# EasyEDA Pro project ProPrj_闯红灯监控系统_2025-10-04.epro

# Schematic Schematic1
Board Name: Board1; Create Date: 2025-05-07; Page Name: P1; Project Name: 闯红灯监控系统; Schematic Name: Schematic1; Update Date: 2025-06-06; Company: 嘉立创EDA; Page Size: A4; Version: V1.0
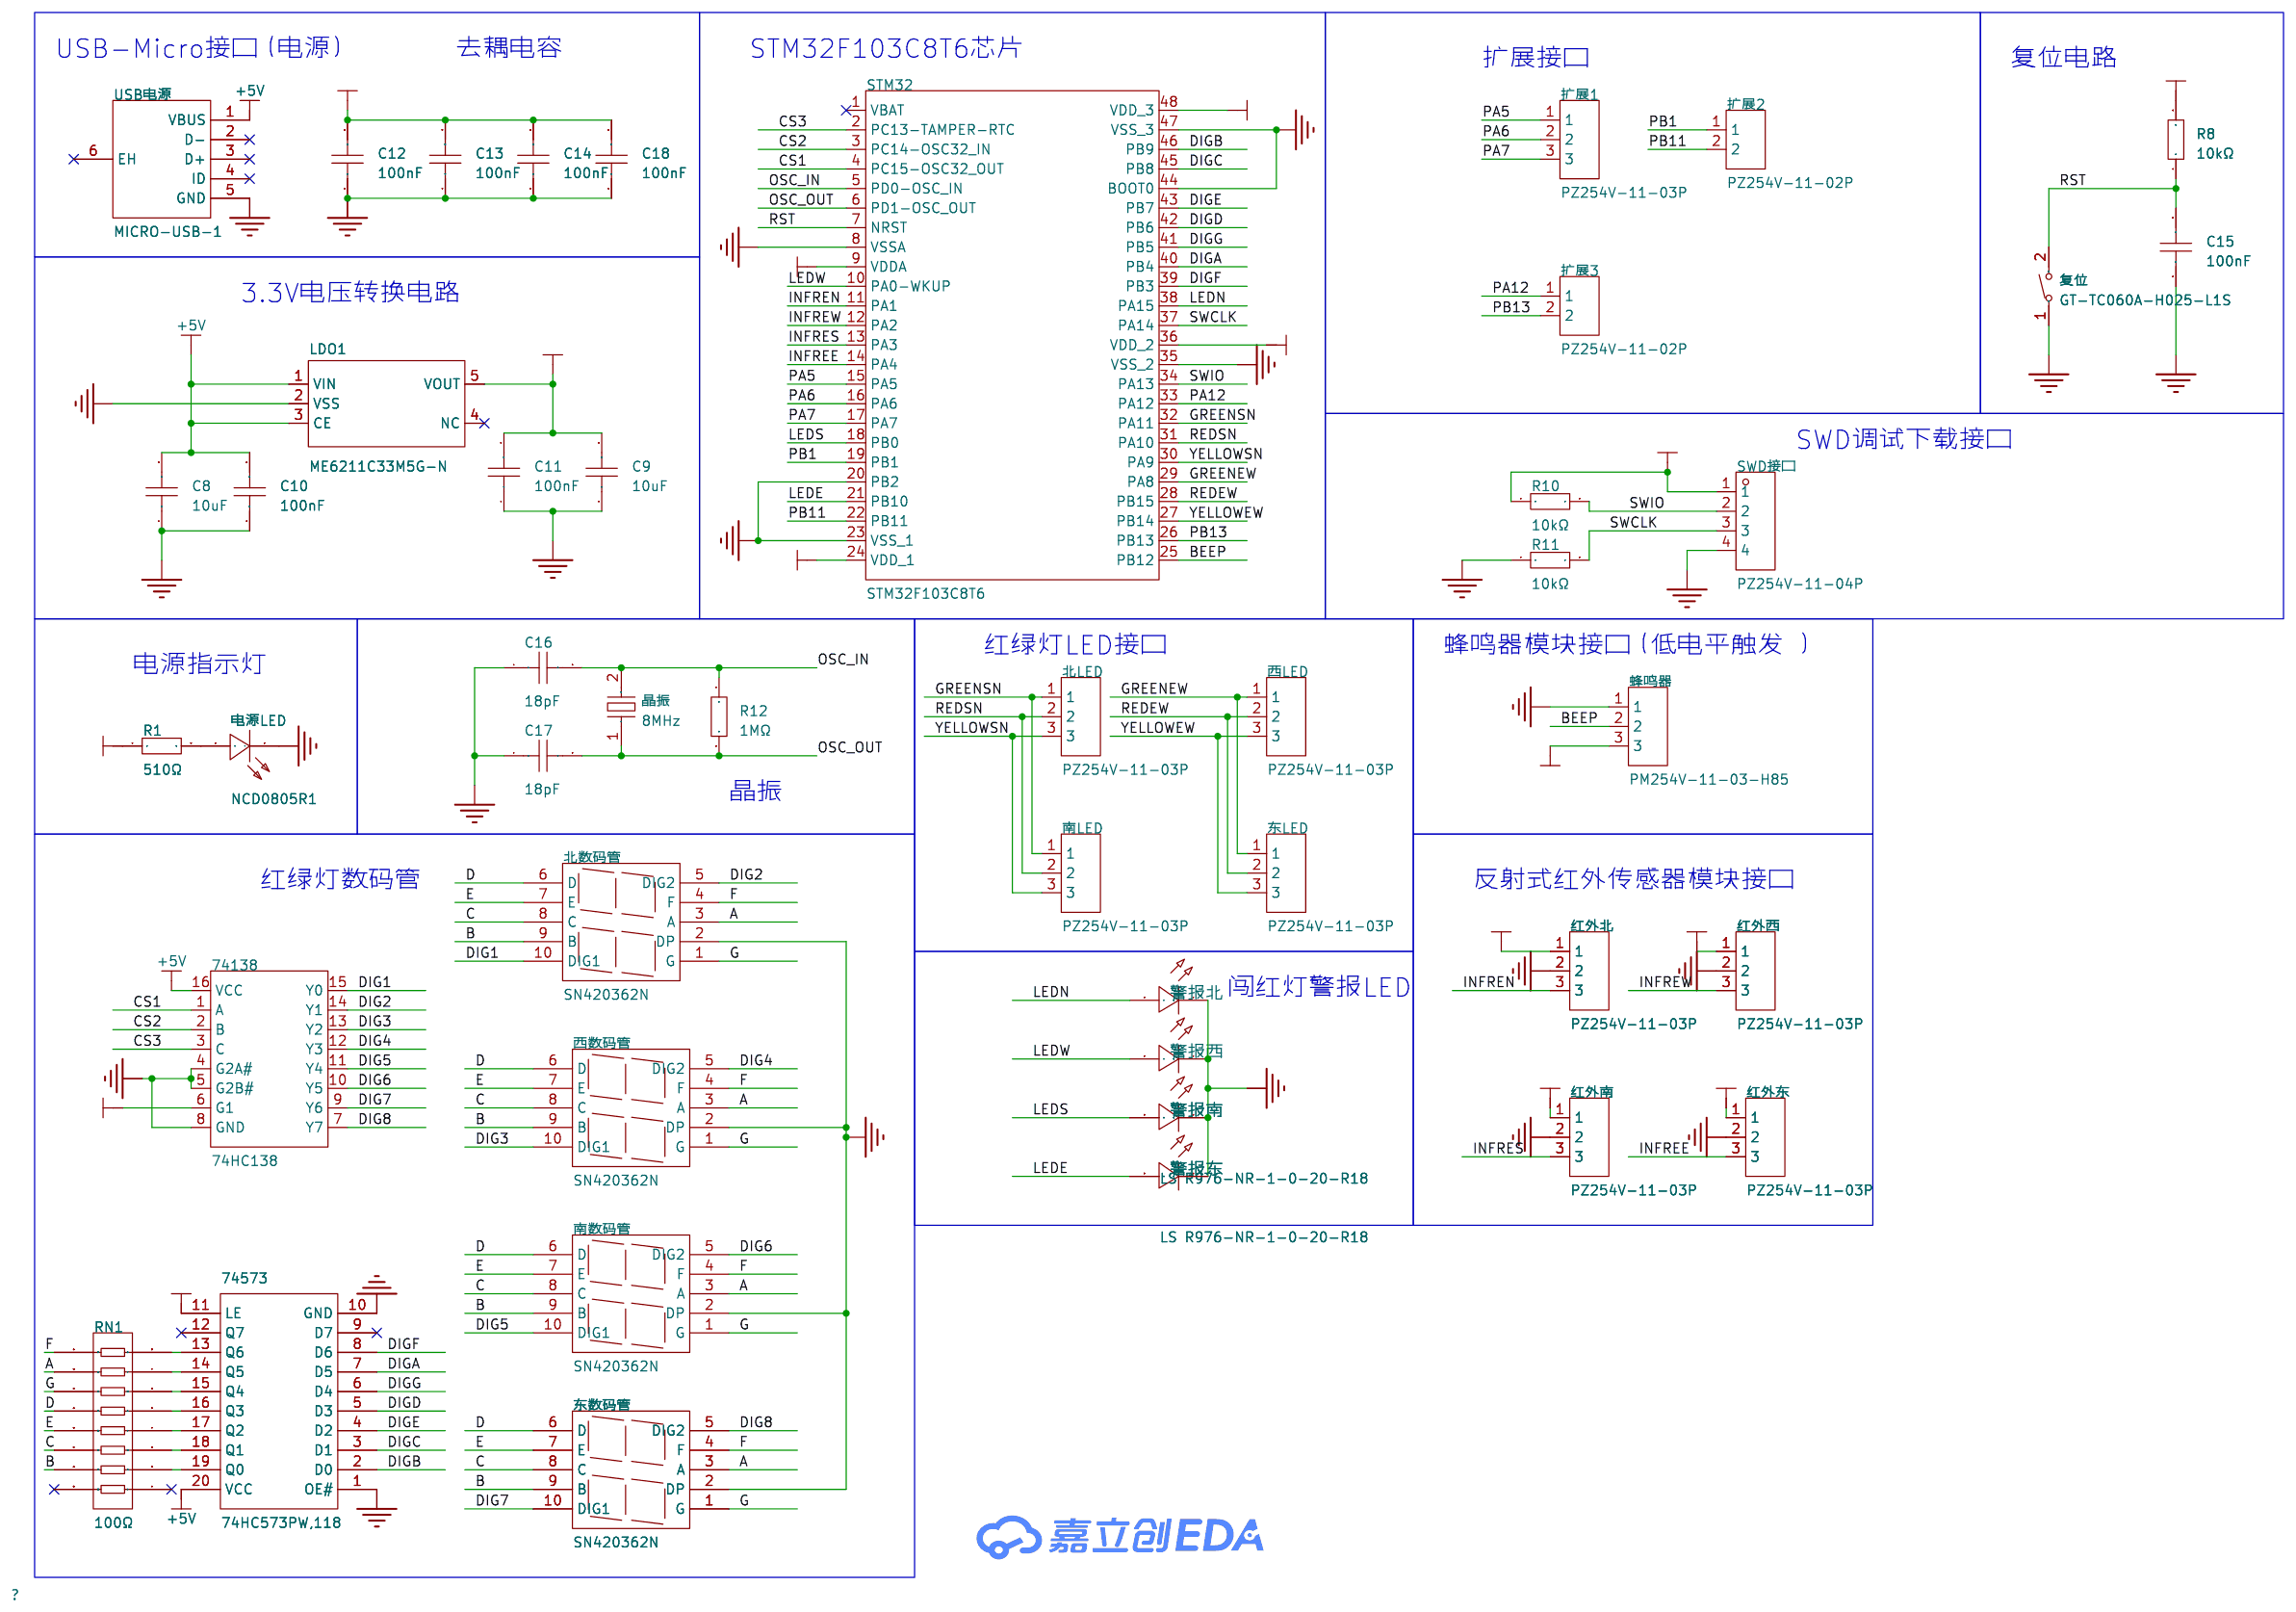
[diagram p0: schematic sheet]

## Parts
74138  74HC138  [SOP-16_L10.0-W3.9-P1.27-LS6.0-BL]
74573  74HC573PW,118  [TSSOP-20_L6.5-W4.4-P0.65-LS6.4-BL]
C8  10uF  [C0805]
C9  10uF  [C0805]
C10  100nF  [C0805]
C11  100nF  [C0805]
C12  100nF  [C0805]
C13  100nF  [C0805]
C14  100nF  [C0805]
C15  100nF  [C0805]
C16  18pF  [C0805]
C17  18pF  [C0805]
C18  100nF  [C0805]
LDO1  ME6211C33M5G-N  [SOT-23-5_L3.0-W1.7-P0.95-LS2.8-BL]
R1  510Ω  [R0805]
R8  10kΩ  [R0805]
R10  10kΩ  [R0805]
R11  10kΩ  [R0805]
R12  1MΩ  [R0805]
RN1  100Ω  [RES-ARRAY-SMD_16P-L3.8-W1.6-P0.50-BL]
STM32  STM32F103C8T6  [LQFP-48_L7.0-W7.0-P0.50-LS9.0-BL]
SWD接口  PZ254V-11-04P  [HDR-TH_4P-P2.54-V-M]
USB电源  MICRO-USB-1  [MICRO-USB-SMD_C9900008946]
东LED  PZ254V-11-03P  [HDR-TH_3P-P2.54-V-M]
东数码管  SN420362N  [LED-SEG-TH_10P-L15.0-W14.0-P2.54-S10.16-BL]
北LED  PZ254V-11-03P  [HDR-TH_3P-P2.54-V-M]
北数码管  SN420362N  [LED-SEG-TH_10P-L15.0-W14.0-P2.54-S10.16-BL]
南LED  PZ254V-11-03P  [HDR-TH_3P-P2.54-V-M]
南数码管  SN420362N  [LED-SEG-TH_10P-L15.0-W14.0-P2.54-S10.16-BL]
复位  GT-TC060A-H025-L1S  [SW-SMD_L6.1-W3.5-LS8.0]
扩展1  PZ254V-11-03P  [HDR-TH_3P-P2.54-V-M]
扩展2  PZ254V-11-02P  [HDR-TH_2P-P2.54-V-M]
扩展3  PZ254V-11-02P  [HDR-TH_2P-P2.54-V-M]
晶振  8MHz  [HC-49US_L11.5-W4.5-P4.88]
电源LED  NCD0805R1  [LED0805-R-RD]
红外东  PZ254V-11-03P  [HDR-TH_3P-P2.54-V-M]
红外北  PZ254V-11-03P  [HDR-TH_3P-P2.54-V-M]
红外南  PZ254V-11-03P  [HDR-TH_3P-P2.54-V-M]
红外西  PZ254V-11-03P  [HDR-TH_3P-P2.54-V-M]
蜂鸣器  PM254V-11-03-H85  [HDR-TH_3P-P2.54-V-F]
西LED  PZ254V-11-03P  [HDR-TH_3P-P2.54-V-M]
西数码管  SN420362N  [LED-SEG-TH_10P-L15.0-W14.0-P2.54-S10.16-BL]
警报东  LS R976-NR-1-0-20-R18  [LED0805-RD_RED]
警报北  北  [LED_0805]
警报南  LS R976-NR-1-0-20-R18  [LED0805-RD_RED]
警报西  西  [LED_0805]

## Library data of the parts
74138 = 74HC138_C18164491: 供电电压:2V~6V;线路数:3~8;灌电流(IOL):5.2mA;拉电流(IOH):5.2mA;; Supplier Part: C18164491; Manufacturer: GR(国睿); Supplier Footprint: SOP-16; JLCPCB Part Class: Extended Part; Datasheet: https://atta.szlcsc.com/upload/public/pdf/source/20230915/1875FD9BBCBC078FA2EE33B300B49074.pdf; Supplier: LCSC; Type: 译码器; Voltage Supply Source: 单电源; Supply Voltage: 2V~6V; Number of lines: 3~8; Sink Current: 5.2mA; Source Current: 5.2mA; Operating temperature: 0℃~+70℃
74573 = 74HC573PW,118: 逻辑类型:D型锁存器;电源电压:2V~6V;通道数:8;传播延迟:14ns;; LCSC Part Name: 三态输出八路D型锁存器; Supplier Part: C5944; Manufacturer: Nexperia(安世); Supplier Footprint: TSSOP-20; JLCPCB Part Class: Extended Part; Datasheet: https://atta.szlcsc.com/upload/public/pdf/source/20240724/96C0CD19AF0910193CE40AAA63B442F9.pdf; Supplier: LCSC; Logic Type: D型锁存器; Output Type: 三态; Supply Voltage: 2V~6V; Number of Channels: 8; Source Current: 7.8mA; Sink Current: 7.8mA; Propagation Delay: 14ns; Series: 74HC; OperatingTemperature: -40℃~+125℃
C8 C9 = CGA0805X5R106K250MT: 容值:10uF;精度:±10%;额定电压:25V;温度系数:X5R;; LCSC Part Name: 10uF ±10% 25V; Supplier Part: C6119887; Manufacturer: HRE(芯声); Supplier Footprint: 0805; JLCPCB Part Class: Extended Part; Supplier: LCSC; Tolerance: ±10%; Voltage Rating: 25V; Temperature Coefficient: X5R
C10-C15 C18 = CC0805KRX7R9BB104: 容值:100nF;精度:±10%;额定电压:50V;材质(温度系数):X7R;; LCSC Part Name: 100nF ±10% 50V; Supplier Part: C49678; Manufacturer: YAGEO(国巨); Supplier Footprint: 0805; JLCPCB Part Class: Basic Part; Datasheet: https://atta.szlcsc.com/upload/public/pdf/source/20180224/C181747_15194369449651363981.pdf; Supplier: LCSC; Tolerance: ±10%; Voltage Rated: 50V; Temperature Coefficient: X7R
C16 C17 = CGA0805C0G180J500HT: 容值:18pF;精度:±5%;额定电压:50V;温度系数:C0G;; LCSC Part Name: 18pF ±5% 50V; Supplier Part: C22399633; Manufacturer: HRE(芯声); Supplier Footprint: 0805; JLCPCB Part Class: Extended Part; Datasheet: https://atta.szlcsc.com/upload/public/pdf/source/20240523/91F7B9E5D9B74CA1D3684C78FC7C8C29.pdf; Supplier: LCSC; Tolerance: ±5%; Voltage Rating: 50V; Temperature Coefficient: C0G
LDO1 = ME6211C33M5G-N: 输出类型:固定;工作电压:6V;输出电压:3.3V;输出电流:500mA;电源纹波抑制比(PSRR):70dB@(1kHz)；62dB@(10kHz);输出极性:正极;; LCSC Part Name: 输入6V 输出3.3V 500mA; Supplier Part: C82942; Manufacturer: MICRONE(南京微盟); Supplier Footprint: SOT-23-5; JLCPCB Part Class: Extended Part; Datasheet: https://atta.szlcsc.com/upload/public/pdf/source/20170918/C82942_1505727073070976520.pdf; Supplier: LCSC; Output Type: 固定; Voltage - Supply: 6V; Output Voltage: 3.3V; Output Current: 500mA; Power Supply Rejection Ratio (PSRR): 70dB@(1kHz)；62dB@(10kHz); Voltage Dropout: 260mV@(200mA); Features: 短路保护(SCP)；低ESR；过流保护(OCP)；带使能; Output Configuration: 正极; Number of Outputs: 1
R1 = 0805W8F5100T5E: 电阻类型:厚膜电阻;阻值:510Ω;精度:±1%;功率:125mW;最大工作电压:150V;温度系数:±100ppm/℃;; LCSC Part Name: 510Ω ±1% 125mW 厚膜电阻; Supplier Part: C17734; Manufacturer: UNI-ROYAL(厚声); Supplier Footprint: 0805; JLCPCB Part Class: Basic Part; Datasheet: https://atta.szlcsc.com/upload/public/pdf/source/20200306/C422600_1E6D84923E4A46A82E41ADD87F860B5C.pdf; Supplier: LCSC; Type: 厚膜电阻; Tolerance: ±1%; Power(Watts): 125mW; Overload Voltage (Max): 150V; Temperature Coefficient: ±100ppm/℃; Operating Temperature Range: -55℃~+155℃
R8 R10 R11 = 0805W8F1002T5E_C17414: 电阻类型:厚膜电阻;阻值:10kΩ;精度:±1%;功率:125mW;最大工作电压:150V;温度系数:±100ppm/℃;; LCSC Part Name: 10kΩ ±1% 125mW 厚膜电阻; Supplier Part: C17414; Manufacturer: UNI-ROYAL(厚声); Manufacturer Part: 0805W8F1002T5E; Supplier Footprint: 0805; JLCPCB Part Class: Basic Part; Datasheet: https://atta.szlcsc.com/upload/public/pdf/source/20200306/C422600_1E6D84923E4A46A82E41ADD87F860B5C.pdf; Supplier: LCSC; Type: 厚膜电阻; Tolerance: ±1%; Power(Watts): 125mW; Overload Voltage (Max): 150V; Temperature Coefficient: ±100ppm/℃; Operating Temperature Range: -55℃~+155℃
R12 = 0805W8F1004T5E: 电阻类型:厚膜电阻;阻值:1MΩ;精度:±1%;功率:125mW;最大工作电压:150V;温度系数:±100ppm/℃;; LCSC Part Name: 1MΩ ±1% 125mW 厚膜电阻; Supplier Part: C17514; Manufacturer: UNI-ROYAL(厚声); Supplier Footprint: 0805; JLCPCB Part Class: Basic Part; Datasheet: https://atta.szlcsc.com/upload/public/pdf/source/20200306/C422600_1E6D84923E4A46A82E41ADD87F860B5C.pdf; Supplier: LCSC; Type: 厚膜电阻; Tolerance: ±1%; Power(Watts): 125mW; Overload Voltage (Max): 150V; Temperature Coefficient: ±100ppm/℃; Operating Temperature Range: -55℃~+155℃
RN1 = EXB2HV101JV: 电阻器数:8;阻值:100Ω;精度:±5%;单个元件功率:63mW;温度系数:±100ppm/℃;; LCSC Part Name: 100Ω ±5%; Supplier Part: C713452; Manufacturer: PANASONIC(松下); Supplier Footprint: SMD-16P,1.6x3.8mm; JLCPCB Part Class: Extended Part; Datasheet: https://atta.szlcsc.com/upload/public/pdf/source/20200731/C713452_CB858C4E526F7E442360E62859A998EA.pdf; Supplier: LCSC; Number of Resistors: 8; Tolerance: ±5%; Power(Watts): 63mW; Temperature Coefficient: ±100ppm/℃; Number of Pins: 16
STM32 = STM32F103C8T6: CPU内核:ARM-M3;CPU最大主频:72MHz;应用领域:-;; LCSC Part Name: 主流增强型ARM Cortex-M3 MCU，具有64 KB Flash、72 MHz CPU、电机控制、USB和CAN; Supplier Part: C8734; Manufacturer: ST(意法半导体); Supplier Footprint: LQFP-48(7x7); JLCPCB Part Class: Extended Part; Datasheet: https://atta.szlcsc.com/upload/public/pdf/source/20220812/8363ACEC51AD55ECEB84799464F7CB85.pdf; Supplier: LCSC; CPU Core: ARM-M3; CPU Maximum Speed: 72MHz; Program Storage Size: 64KB; Program Memory Type: FLASH; Number of I/O: 37; ADC (Bit): 12bit; Low Voltage Detection Threshold: 2V~3.6V
SWD接口 = PZ254V-11-04P: 插针结构:1x4P;间距:2.54mm;行距:-;圆针/方针:方针;安装类型:直插;排数:单排;总PIN位数:4P;额定电流:3A;额定电压:250V;配合针长度:6mm;塑高:2.5mm;端接针长度:3mm;触头材质:-;工作温度范围:-40℃~+105℃;颜色:黑色;; LCSC Part Name: 间距:2.54mm 1x4P 直插 方针; Supplier Part: C2691448; Manufacturer: XFCN(兴飞); Supplier Footprint: 插件,P=2.54mm; JLCPCB Part Class: Extended Part; Datasheet: https://atta.szlcsc.com/upload/public/pdf/source/20200309/C492403_F9F19131791D08044AD4F84F8E751A34.pdf; Supplier: LCSC; Pin Structure: 1x4P; Pitch: 2.54mm; Circluar Pins/Square Pins: 方针; Mounting Type: 直插; Number of Rows: 单排; Number of Pins: 4P; Current Rating (Max): 3A; Voltage Rating (Max): 250V; Length of Mating Pin: 6mm; Insulation Height: 2.5mm; Length of End Connection Pin: 3mm; Operating Temperature Range: -40℃~+105℃; Color: 黑色
USB电源 = MICRO-USB-1: Supplier Part: C9900008946; Supplier Footprint: USB-micro; JLCPCB Part Class: Extended Part; Supplier: LCSC
东LED 北LED 南LED 扩展1 红外东 红外北 红外南 红外西 西LED = PZ254V-11-03P: 插针结构:1x3P;间距:2.54mm;行距:-;圆针/方针:方针;安装方式:直插;排数:单排;总PIN位数:3P;额定电流:3A;额定电压:250V;配合针长度:6mm;塑高:2.5mm;端接针长度:3mm;工作温度:-40℃~+105℃;颜色:黑色;; LCSC Part Name: 1x3P 间距:2.54mm 方针 直插; Supplier Part: C2937625; Manufacturer: XFCN(兴飞); Supplier Footprint: 插件,P=2.54mm; JLCPCB Part Class: Extended Part; Datasheet: https://atta.szlcsc.com/upload/public/pdf/source/20200309/C492402_8335C3D49C4E4C618838D59BB1D024C1.pdf; Supplier: LCSC; Pin Structure: 1x3P; Pitch: 2.54mm; Circluar Pins/Square Pins: 方针; Mounting Type: 直插; Number of Rows: 单排; Number of Pins: 3P; Current Rating: 3A; Voltage Rating (Max): 250V; Length of Mating Pin: 6mm; Insulation Height: 2.5mm; Length of End Connection Pin: 3mm; Operating Temperature: -40℃~+105℃; Color: 黑色
东数码管 北数码管 南数码管 西数码管 = SN420362N: 数码管位数:2位;耗散功率(Pd):50mW;发光颜色:红色;LED极性:共阴极;数字/字母大小(英寸):0.36;; LCSC Part Name: 2位0.36英寸红色数码管 共阴极; Supplier Part: C193138; Manufacturer: ARKLED(方舟); Supplier Footprint: 插件; JLCPCB Part Class: Extended Part; Datasheet: https://atta.szlcsc.com/upload/public/pdf/source/20180614/C193138_5428A70B035656625A7C18FB064A931D.pdf; Supplier: LCSC; Number of Characters: 2位; Display Type: 7段; Size / Dimension: 15mmx14mmx7.2mm; Pd - Power Dissipation: 50mW; Illumination Color: 红色; LED Polarity: 共阴极; Digit/Alpha Size(inch): 0.36
复位 = GT-TC060A-H025-L1S: 电路结构:单刀单掷;作用力:1.6N;安装方式:立贴;带支架:不带;触点电流:50mA;额定电压(AC):12V;额定电压(DC):12V;绝缘电阻:100MΩ;带灯:无;机械寿命:10万次;; LCSC Part Name: 3×6×2.5 立贴 无声轻触开关; Supplier Part: C7450623; Manufacturer: G-Switch(品赞); Supplier Footprint: SMD,3x6mm; JLCPCB Part Class: Extended Part; Datasheet: https://atta.szlcsc.com/upload/public/pdf/source/20230712/3FF422A4BEDB42853830040444FDF292.pdf; Supplier: LCSC; Circuit: 单刀单掷; Operating Force: 1.6N; Mounting Style: 立贴; Strike Gundam: 不带; Contact Current: 50mA; Voltage Rating (AC): 12V; Voltage Rating (DC): 12V; Insulation Resistance: 100MΩ; With Lamp: 无; Mechanical Life: 10万次
扩展2 扩展3 = PZ254V-11-02P: 插针结构:1x2P;间距:2.54mm;行距:-;圆针/方针:方针;安装方式:直插;排数:单排;总PIN位数:2P;额定电流:-;额定电压:-;配合针长度:6mm;塑高:2.5mm;端接针长度:3mm;触头材质:黄铜;触头镀层:-;工作温度:-40℃~+105℃;颜色:黑色;; LCSC Part Name: 1x2P 间距:2.54mm 方针 直插; Supplier Part: C492401; Manufacturer: XFCN(兴飞); Supplier Footprint: 插件,P=2.54mm; JLCPCB Part Class: Extended Part; Datasheet: https://atta.szlcsc.com/upload/public/pdf/source/20200309/C492401_A812433581A9B211A7FFA413ADDFF0E5.pdf; Supplier: LCSC; Pin Structure: 1x2P; Pitch: 2.54mm; Circluar Pins/Square Pins: 方针; Mounting Type: 直插; Number of Rows: 单排; Number of Pins: 2P; Length of Mating Pin: 6mm; Insulation Height: 2.5mm; Length of End Connection Pin: 3mm; Contact Material: 黄铜; Operating Temperature: -40℃~+105℃; Color: 黑色
晶振 = ABL-8.000MHZ-B2-T: 频率:8MHz;常温频差:±20ppm;负载电容:18pF;频率稳定度(全温):±50ppm;; LCSC Part Name: 8MHz ±20ppm 18pF; Supplier Part: C6455706; Manufacturer: ABRACON; Supplier Footprint: HC-49US; JLCPCB Part Class: Extended Part; Datasheet: https://atta.szlcsc.com/upload/public/pdf/source/20231016/AD8D1059740F0944BD2562948A485B35.pdf; Supplier: LCSC; Normal temperature Frequency Tolerance: ±20ppm; Load Capacitor: 18pF; Frequency Stability(Full temperature range): ±50ppm; Equivalent Series Resistance (ESR): 80Ω; Operating Temperature: -20℃~+70℃
电源LED = NCD0805R1: 灯头类型:-;发光颜色:红色;正向电压(VF):1.6V~2.6V;功率:65mW;正向电流:20mA;主波长:615nm~630nm;二极管配置:独立二极管;透镜颜色:无色透明透镜;色温:-;发光强度:67mcd~195mcd;发光角度:130°;载带方式:-;工作温度:-30℃~+85℃;; Supplier Part: C84256; Manufacturer: 国星光电; Supplier Footprint: 0805; JLCPCB Part Class: Basic Part; Datasheet: https://atta.szlcsc.com/upload/public/pdf/source/20200820/C84256_F0A75A43B3EAD75808600A0514C76B99.pdf; Supplier: LCSC; Emitted Color: 红色; Forward Voltage (VF): 1.6V~2.6V; Power Dissipation: 65mW; Forward Current: 20mA; Dominant Wavelength: 615nm~630nm; Diode Configuration: 独立二极管; Lens Color: 无色透明透镜; Luminous Intensity: 67mcd~195mcd; Viewing Angle: 130°; Operating Temperature: -30℃~+85℃
蜂鸣器 = PM254V-11-03-H85: 插孔结构:1x3P;间距:2.54mm;行距:-;安装类型:直插;排数:单排;总孔位数:3P;塑高:-;触头材质:黄铜;触头镀层:-;; LCSC Part Name: 间距:2.54mm 1x3P 直插; Supplier Part: C541850; Manufacturer: XFCN(兴飞); Supplier Footprint: 插件,P=2.54mm; JLCPCB Part Class: Extended Part; Datasheet: https://atta.szlcsc.com/upload/public/pdf/source/20200518/C541849_85853D71FC67C51915A806977A588FDA.pdf; Supplier: LCSC; Holes Structure: 1x3P; Pitch: 2.54mm; Mounting Type: 直插; Number of Rows: 单排; Number of Holes: 3P; Contact Material: 黄铜
警报东 警报南 = LS R976-NR-1-0-20-R18: LCSC Part Name: 0805红(雾状); Supplier Part: C2899997; Manufacturer: OSRAM(欧司朗); Supplier Footprint: 0805; JLCPCB Part Class: Extended Part; Datasheet: https://atta.szlcsc.com/upload/public/pdf/source/20220714/A56A54169E2209C0CCFAD963EE2FAFD1.pdf; Supplier: LCSC
警报北 警报西 = LED_0805-R: Supplier Footprint: 0805

## Nets
+5V: 74138.16(VCC) 74573.20(VCC) C8.2 C10.2 LDO1.1(VIN) LDO1.3(CE) USB电源.1(VBUS)
GND: 74138.4(G2A#) 74138.5(G2B#) 74138.8(GND) 74573.1(OE#) 74573.10(GND) C8.1 C9.1 C10.1 C11.1 C12.1 C13.1 C14.1 C15.1 C16.1 C17.1 C18.1 LDO1.2(VSS) R11.1 STM32.8(VSSA) STM32.20(PB2) STM32.23(VSS_1) STM32.35(VSS_2) STM32.44(BOOT0) STM32.47(VSS_3) SWD接口.4 USB电源.5(GND) 东数码管.2(DP) 北数码管.2(DP) 南数码管.2(DP) 复位.1 电源LED.2(-) 红外东.2 红外北.2 红外南.2 红外西.2 蜂鸣器.1 西数码管.2(DP) 警报东.1(C) 警报北.1(C) 警报南.1(C) 警报西.1(C)
VCC_3V3: 74138.6(G1) 74573.11(LE) C9.2 C11.2 C12.2 C13.2 C14.2 C18.2 LDO1.5(VOUT) R1.1 R8.2 R10.1 STM32.9(VDDA) STM32.24(VDD_1) STM32.36(VDD_2) STM32.48(VDD_3) SWD接口.1 红外东.1 红外北.1 红外南.1 红外西.1 蜂鸣器.3
A: RN1.10 东数码管.3(A) 北数码管.3(A) 南数码管.3(A) 西数码管.3(A)
B: RN1.15 东数码管.9(B) 北数码管.9(B) 南数码管.9(B) 西数码管.9(B)
BEEP: STM32.25(PB12) 蜂鸣器.2
C: RN1.14 东数码管.8(C) 北数码管.8(C) 南数码管.8(C) 西数码管.8(C)
CS1: 74138.1(A) STM32.4(PC15-OSC32_OUT)
CS2: 74138.2(B) STM32.3(PC14-OSC32_IN)
CS3: 74138.3(C) STM32.2(PC13-TAMPER-RTC)
D: RN1.12 东数码管.6(D) 北数码管.6(D) 南数码管.6(D) 西数码管.6(D)
DIG1: 74138.15(Y0) 北数码管.10(DIG1)
DIG2: 74138.14(Y1) 北数码管.5(DIG2)
DIG3: 74138.13(Y2) 西数码管.10(DIG1)
DIG4: 74138.12(Y3) 西数码管.5(DIG2)
DIG5: 74138.11(Y4) 南数码管.10(DIG1)
DIG6: 74138.10(Y5) 南数码管.5(DIG2)
DIG7: 74138.9(Y6) 东数码管.10(DIG1)
DIG8: 74138.7(Y7) 东数码管.5(DIG2)
DIGA: 74573.7(D5) STM32.40(PB4)
DIGB: 74573.2(D0) STM32.46(PB9)
DIGC: 74573.3(D1) STM32.45(PB8)
DIGD: 74573.5(D3) STM32.42(PB6)
DIGE: 74573.4(D2) STM32.43(PB7)
DIGF: 74573.8(D6) STM32.39(PB3)
DIGG: 74573.6(D4) STM32.41(PB5)
E: RN1.13 东数码管.7(E) 北数码管.7(E) 南数码管.7(E) 西数码管.7(E)
F: RN1.9 东数码管.4(F) 北数码管.4(F) 南数码管.4(F) 西数码管.4(F)
G: RN1.11 东数码管.1(G) 北数码管.1(G) 南数码管.1(G) 西数码管.1(G)
GREENEW: STM32.29(PA8) 东LED.1 西LED.1
GREENSN: STM32.32(PA11) 北LED.1 南LED.1
INFREE: STM32.14(PA4) 红外东.3
INFREN: STM32.11(PA1) 红外北.3
INFRES: STM32.13(PA3) 红外南.3
INFREW: STM32.12(PA2) 红外西.3
LEDE: STM32.21(PB10) 警报东.2(A)
LEDN: STM32.38(PA15) 警报北.2(A)
LEDS: STM32.18(PB0) 警报南.2(A)
LEDW: STM32.10(PA0-WKUP) 警报西.2(A)
OSC_IN: C16.2 R12.1 STM32.5(PD0-OSC_IN) 晶振.2
OSC_OUT: C17.2 R12.2 STM32.6(PD1-OSC_OUT) 晶振.1
PA5: STM32.15(PA5) 扩展1.1
PA6: STM32.16(PA6) 扩展1.2
PA7: STM32.17(PA7) 扩展1.3
PA12: STM32.33(PA12) 扩展3.1
PB1: STM32.19(PB1) 扩展2.1
PB11: STM32.22(PB11) 扩展2.2
PB13: STM32.26(PB13) 扩展3.2
REDEW: STM32.28(PB15) 东LED.2 西LED.2
REDSN: STM32.31(PA10) 北LED.2 南LED.2
RST: C15.2 R8.1 STM32.7(NRST) 复位.2
SWCLK: R11.2 STM32.37(PA14) SWD接口.3
SWIO: R10.2 STM32.34(PA13) SWD接口.2
YELLOWEW: STM32.27(PB14) 东LED.3 西LED.3
YELLOWSN: STM32.30(PA9) 北LED.3 南LED.3
$1N2600: R1.2 电源LED.1(+)
$1N11019: 74573.19(Q0) RN1.2
$1N11023: 74573.18(Q1) RN1.3
$1N11028: 74573.17(Q2) RN1.4
$1N11033: 74573.16(Q3) RN1.5
$1N11038: 74573.15(Q4) RN1.6
$1N11043: 74573.14(Q5) RN1.7
$1N11048: 74573.13(Q6) RN1.8

Not connected (* = marked no-connect by the designer): 74573 9(D7)* 12(Q7)*; LDO1 4(NC)*; RN1 1* 16*; STM32 1(VBAT)*; USB电源 2(D-)* 3(D+)* 4(ID)* 6(EH)*

## Notes on the sheet
- USB-Micro接口（电源）
- 去耦电容
- STM32F103C8T6芯片
- 扩展接口
- 复位电路
- 3.3V电压转换电路
- SWD调试下载接口
- 红绿灯LED接口
- 蜂鸣器模块接口（低电平触发 ）
- 电源指示灯
- 晶振
- 红绿灯数码管
- 反射式红外传感器模块接口
- 闯红灯警报LED

# Board PCB1
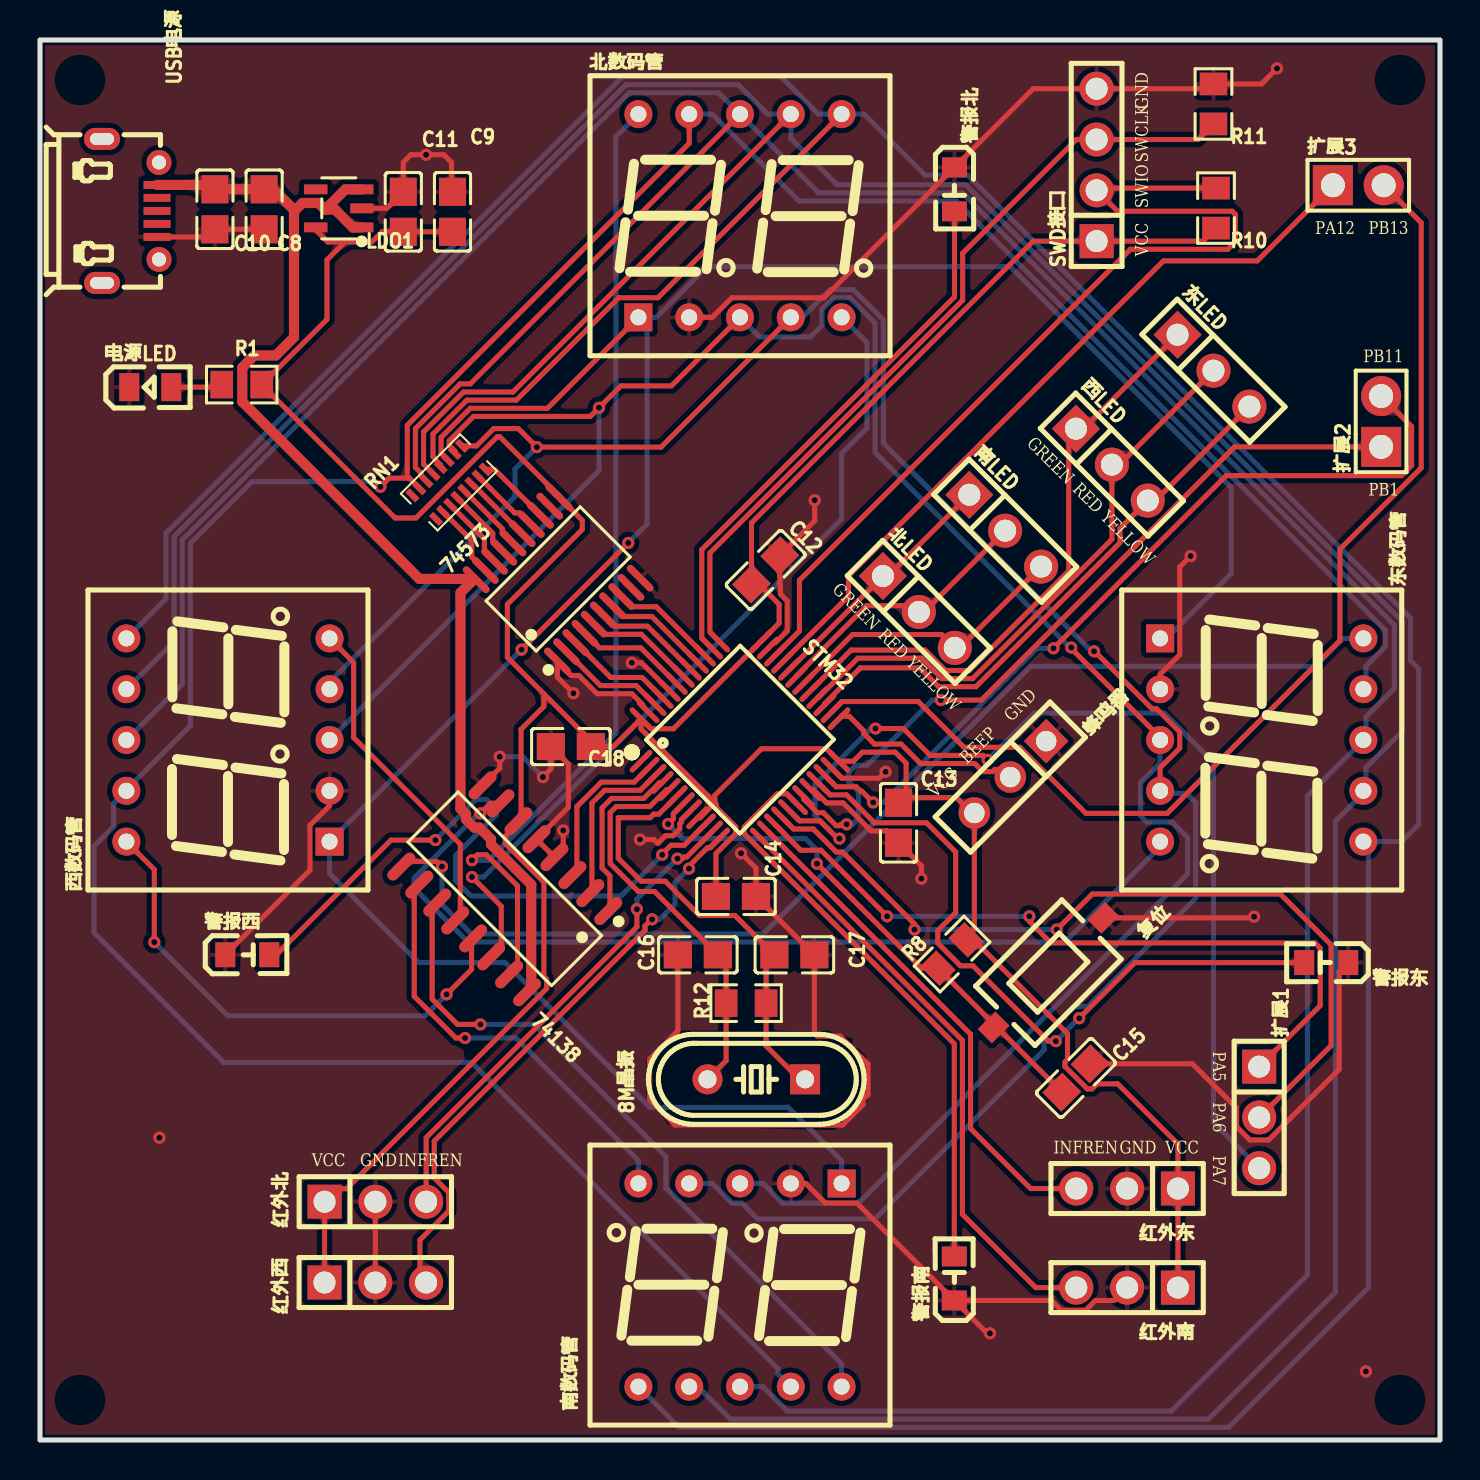
[diagram p1: board, top side]
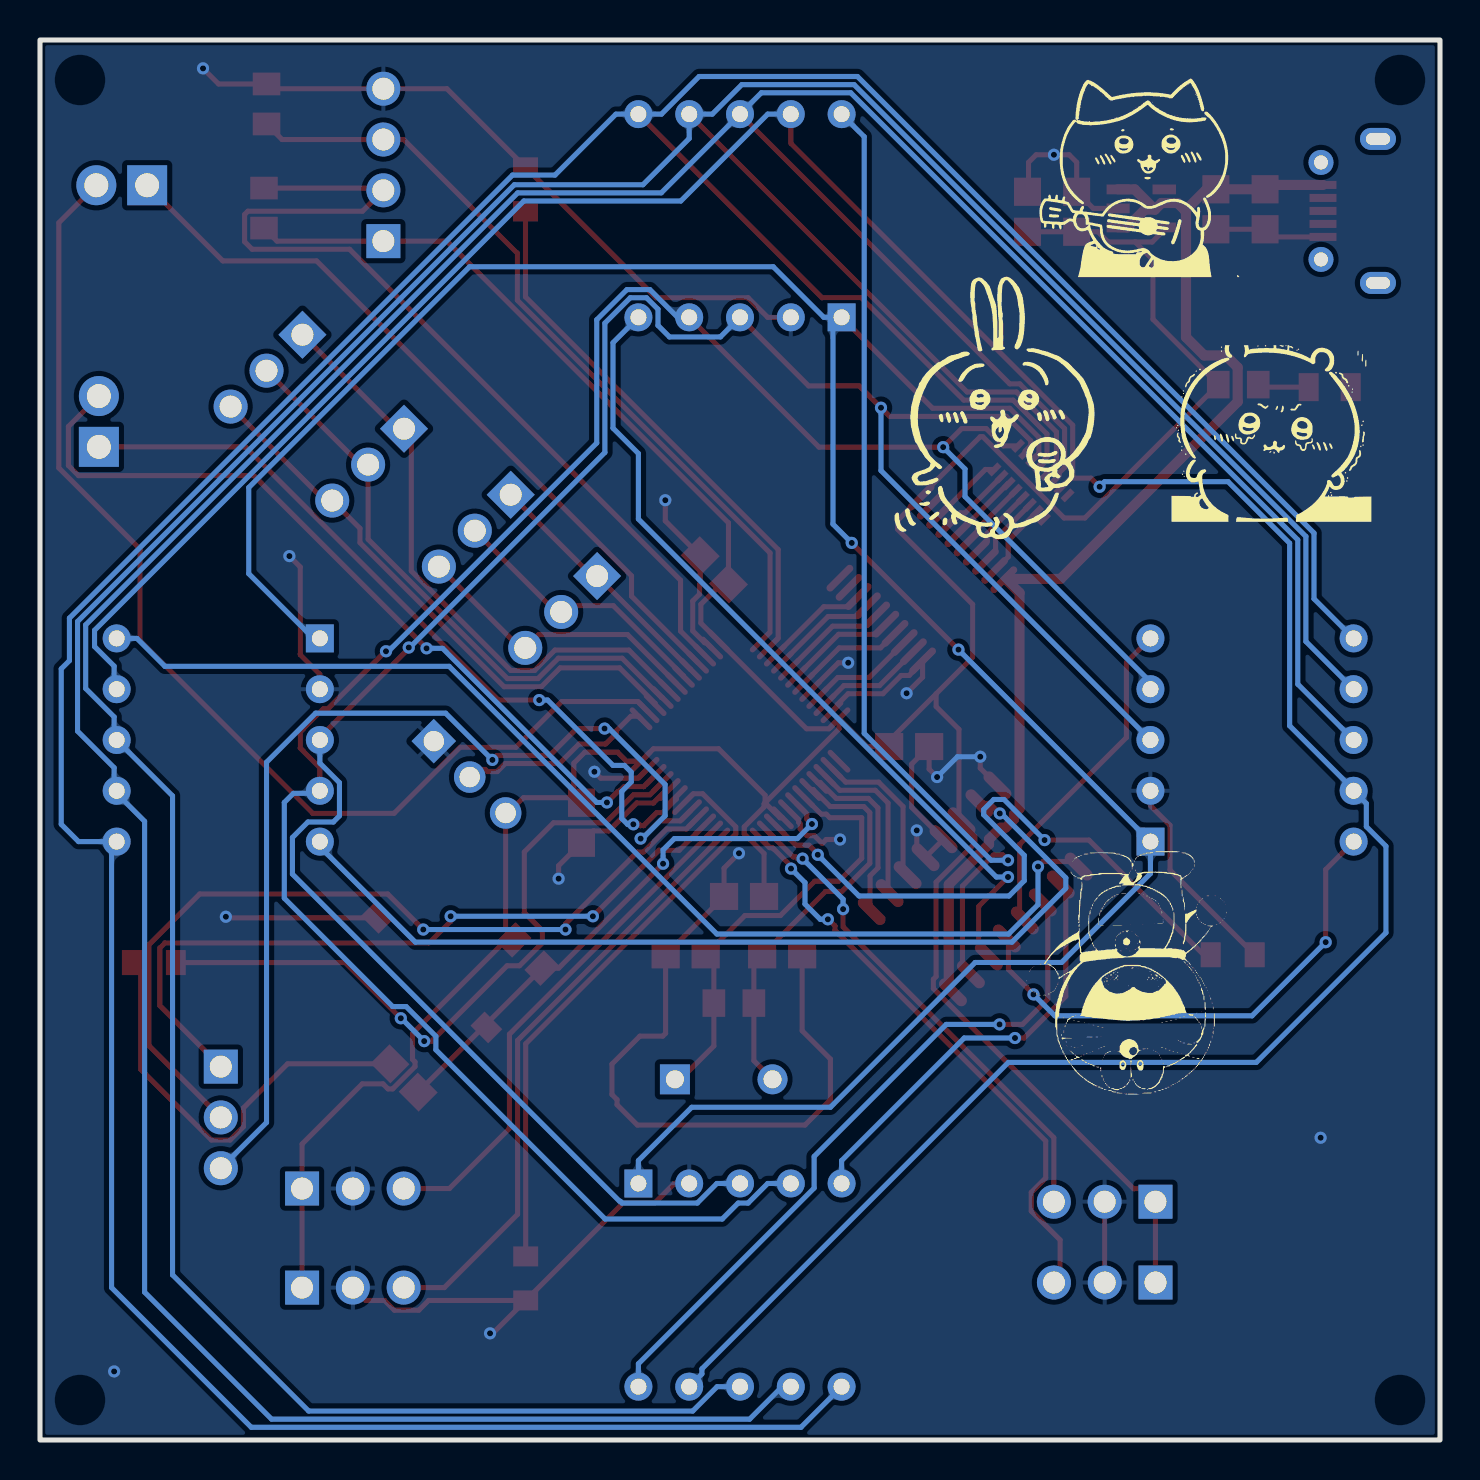
[diagram p2: board, bottom side, seen from below]

Outline 70 x 70 mm; copper layers: Top Layer, Bottom Layer. Coordinates in mm from the lower left corner of the outline.
Outline path: rectangle 0,0 70,70
Stack: Top Layer 0.035mm / Dielectric1 1.51mm FR4 er 4.5 / Bottom Layer 0.035mm

## Design rules (mm)
template: 自定义配置
spacing copperThickness1oz (default): track to track 0.152, other pairs 0.152 to 0.3
spacing copperThickness2oz: track to track 0.203, other pairs 0.152 to 0.3
track width copperThickness1oz (default): min 0.254, default 0.254, max 0.762
track width copperThickness2oz: min 0.203, default 0.254, max 2.54
track width 5V: min 0.508, default 0.508, max 0.762
differential pair differentialPair (default): width min 0.127, default 0.254, max 2.54; gap min 0.152, default 0.152
via viaSize (default): diameter min 0.5, default 0.61, max 10; hole min 0.3, default 0.305, max 6.299
net +5V uses 5V

## Placement (name value [footprint] x y rotation side)
8M晶振  8MHz  [HC-49US_L11.5-W4.5-P4.88]  35.81 18.03 180 top
74138  74HC138  [SOP-16_L10.0-W3.9-P1.27-LS6.0-BL]  23.24 27.56 135 top
74573  74HC573PW,118  [TSSOP-20_L6.5-W4.4-P0.65-LS6.4-BL]  25.91 43.05 45 top
C8  10uF  [C0805]  11.21 61.54 90 top
C9  10uF  [C0805]  20.62 61.41 270 top
C10  100nF  [C0805]  8.75 61.54 90 top
C11  100nF  [C0805]  18.17 61.41 270 top
C12  100nF  [C0805]  36.28 43.51 225 top
C13  100nF  [C0805]  42.93 30.86 90 top
C14  100nF  [C0805]  34.8 27.18 180 top
C15  100nF  [C0805]  51.8 18.1 225 top
C16  18pF  [C0805]  32.89 24.26 0 top
C17  18pF  [C0805]  37.72 24.26 180 top
C18  100nF  [C0805]  26.54 34.67 0 top
LDO1  ME6211C33M5G-N  [SOT-23-5_L3.0-W1.7-P0.95-LS2.8-BL]  14.94 61.58 90 top
R1  510Ω  [R0805]  10.09 52.77 180 top
R8  10kΩ  [R0805]  45.6 24.3 45 top
R10  10kΩ  [R0805]  58.8 61.59 90 top
R11  10kΩ  [R0805]  58.67 66.8 270 top
R12  1MΩ  [R0805]  35.31 21.84 0 top
RN1  100Ω  [RES-ARRAY-SMD_16P-L3.8-W1.6-P0.50-BL]  20.45 47.88 45 top
STM32  STM32F103C8T6  [LQFP-48_L7.0-W7.0-P0.50-LS9.0-BL]  35 35 315 top
SWD接口  PZ254V-11-04P  [HDR-TH_4P-P2.54-V-M]  52.83 63.75 90 top
USB电源  MICRO-USB-1  [MICRO-USB-SMD_C9900008946]  4.53 61.45 270 top
东LED  PZ254V-11-03P  [HDR-TH_3P-P2.54-V-M]  58.67 53.47 315 top
东数码管  SN420362N  [LED-SEG-TH_10P-L15.0-W14.0-P2.54-S10.16-BL]  61.09 35 270 top
北LED  PZ254V-11-03P  [HDR-TH_3P-P2.54-V-M]  43.94 41.4 315 top
北数码管  SN420362N  [LED-SEG-TH_10P-L15.0-W14.0-P2.54-S10.16-BL]  35 61.21 0 top
南LED  PZ254V-11-03P  [HDR-TH_3P-P2.54-V-M]  48.26 45.47 315 top
南数码管  SN420362N  [LED-SEG-TH_10P-L15.0-W14.0-P2.54-S10.16-BL]  35 7.75 180 top
复位  GT-TC060A-H025-L1S  [SW-SMD_L6.1-W3.5-LS8.0]  50.42 23.37 225 top
扩展1  PZ254V-11-03P  [HDR-TH_3P-P2.54-V-M]  60.96 16.13 270 top
扩展2  PZ254V-11-02P  [HDR-TH_2P-P2.54-V-M]  67.06 50.93 90 top
扩展3  PZ254V-11-02P  [HDR-TH_2P-P2.54-V-M]  65.91 62.74 0 top
电源LED  NCD0805R1  [LED0805-R-RD]  5.51 52.64 0 top
红外东  PZ254V-11-03P  [HDR-TH_3P-P2.54-V-M]  54.36 12.57 180 top
红外北  PZ254V-11-03P  [HDR-TH_3P-P2.54-V-M]  16.77 11.91 0 top
红外南  PZ254V-11-03P  [HDR-TH_3P-P2.54-V-M]  54.36 7.62 180 top
红外西  PZ254V-11-03P  [HDR-TH_3P-P2.54-V-M]  16.76 7.87 0 top
蜂鸣器  PM254V-11-03-H85  [HDR-TH_3P-P2.54-V-F]  48.51 33.15 225 top
西LED  PZ254V-11-03P  [HDR-TH_3P-P2.54-V-M]  53.59 48.77 315 top
西数码管  SN420362N  [LED-SEG-TH_10P-L15.0-W14.0-P2.54-S10.16-BL]  9.4 35 90 top
警报东  LS R976-NR-1-0-20-R18  [LED_0805]  64.26 23.88 180 top
警报北  北  [LED_0805]  45.72 62.48 270 top
警报南  LS R976-NR-1-0-20-R18  [LED_0805]  45.72 8.13 90 top
警报西  西  [LED_0805]  10.41 24.26 0 top

## Footprints (pads in the part's own frame, mm; a bottom-side part is the same pattern mirrored in y, then rotated)
C0805
  rect 1.41x1.35 smd: 1(-1,0) 2(1,0)
HC-49US_L11.5-W4.5-P4.88
  rect 1.5x1.5 hole 0.9: 1(-2.44,0)
  round 1.5 hole 0.9: 2(2.44,0)
HDR-TH_2P-P2.54-V-M
  rect 2x2 hole 1.2: 1(-1.27,0)
  round 2 hole 1.2: 2(1.27,0)
HDR-TH_3P-P2.54-V-F
  rect 1.575x1.575 hole 1.02: 1(-2.54,0)
  round 1.575 hole 1.02: 2(0,0) 3(2.54,0)
HDR-TH_3P-P2.54-V-M
  rect 1.7x1.7 hole 1.1: 1(-2.54,0)
  round 1.7 hole 1.1: 2(0,0) 3(2.54,0)
HDR-TH_4P-P2.54-V-M
  rect 1.7x1.7 hole 1.1: 1(-3.81,0)
  round 1.7 hole 1.1: 2(-1.27,0) 3(1.27,0) 4(3.81,0)
LED0805-R-RD
  rect 1x1.399 smd: 1(1.05,0) 2(-1.05,0)
LED-SEG-TH_10P-L15.0-W14.0-P2.54-S10.16-BL
  rect 1.4x1.4 hole 0.8: 1(-5.08,-5.08)
  round 1.4 hole 0.8: 2(-2.54,-5.08) 3(0,-5.08) 4(2.54,-5.08) 5(5.08,-5.08) 6(5.08,5.08) 7(2.54,5.08) 8(0,5.08) 9(-2.54,5.08) 10(-5.08,5.08)
LED_0805
  rect 1x1.25 smd: 1(-1.15,0.005) 2(1.05,0.005)
LQFP-48_L7.0-W7.0-P0.50-LS9.0-BL
  oval 0.27x1.5 smd: 1(-2.75,-4.25) 2(-2.25,-4.25) 3(-1.75,-4.25) 4(-1.25,-4.25) 5(-0.75,-4.25) 6(-0.25,-4.25) 7(0.25,-4.25) 8(0.75,-4.25) 9(1.25,-4.25) 10(1.75,-4.25) 11(2.25,-4.25) 12(2.75,-4.25) 25(2.75,4.25) 26(2.25,4.25) 27(1.75,4.25) 28(1.25,4.25) 29(0.75,4.25) 30(0.25,4.25) 31(-0.25,4.25) 32(-0.75,4.25) 33(-1.25,4.25) 34(-1.75,4.25) 35(-2.25,4.25) 36(-2.75,4.25)
  oval 1.5x0.27 smd: 13(4.25,-2.75) 14(4.25,-2.25) 15(4.25,-1.75) 16(4.25,-1.25) 17(4.25,-0.75) 18(4.25,-0.25) 19(4.25,0.25) 20(4.25,0.75) 21(4.25,1.25) 22(4.25,1.75) 23(4.25,2.25) 24(4.25,2.75) 37(-4.25,2.75) 38(-4.25,2.25) 39(-4.25,1.75) 40(-4.25,1.25) 41(-4.25,0.75) 42(-4.25,0.25) 43(-4.25,-0.25) 44(-4.25,-0.75) 45(-4.25,-1.25) 46(-4.25,-1.75) 47(-4.25,-2.25) 48(-4.25,-2.75)
MICRO-USB-SMD_C9900008946
  rect 0.4x1.35 smd: 1(-1.3,1.325) 2(-0.65,1.325) 3(0,1.325) 4(0.65,1.325) 5(1.3,1.325)
  oval 1.1x1.8 hole 0.6x1.2: 6(-3.6,-1.425) 6(3.6,-1.425)
  round 1.25 hole 0.7: 6(-2.425,1.425) 6(2.425,1.425)
R0805
  rect 1.133x1.377 smd: 1(-1,0) 2(1,0)
RES-ARRAY-SMD_16P-L3.8-W1.6-P0.50-BL
  rect 0.3x0.7 smd: 1(-1.75,-0.833) 2(-1.25,-0.833) 3(-0.75,-0.833) 4(-0.25,-0.833) 5(0.25,-0.833) 6(0.75,-0.833) 7(1.25,-0.833) 8(1.75,-0.833) 9(1.75,0.833) 10(1.25,0.833) 11(0.75,0.833) 12(0.25,0.833) 13(-0.25,0.833) 14(-0.75,0.833) 15(-1.25,0.833) 16(-1.75,0.833)
SOP-16_L10.0-W3.9-P1.27-LS6.0-BL
  oval 0.56x1.745 smd: 1(-4.445,-2.873) 2(-3.175,-2.873) 3(-1.905,-2.873) 4(-0.635,-2.873) 5(0.635,-2.873) 6(1.905,-2.873) 7(3.175,-2.873) 8(4.445,-2.873) 9(4.445,2.873) 10(3.175,2.873) 11(1.905,2.873) 12(0.635,2.873) 13(-0.635,2.873) 14(-1.905,2.873) 15(-3.175,2.873) 16(-4.445,2.873)
SOT-23-5_L3.0-W1.7-P0.95-LS2.8-BL
  rect 0.49x1.157 smd: 1(-0.95,-1.153) 2(0,-1.153) 3(0.95,-1.153)
  rect 0.49x1.175 smd: 4(0.95,1.153) 5(-0.95,1.153)
SW-SMD_L6.1-W3.5-LS8.0
  rect 1.25x1 smd: 1(-3.875,0) 2(3.875,0)
TSSOP-20_L6.5-W4.4-P0.65-LS6.4-BL
  oval 0.364x1.742 smd: 1(-2.925,-2.871) 2(-2.275,-2.871) 3(-1.625,-2.871) 4(-0.975,-2.871) 5(-0.325,-2.871) 6(0.325,-2.871) 7(0.975,-2.871) 8(1.625,-2.871) 9(2.275,-2.871) 10(2.925,-2.871) 11(2.925,2.871) 12(2.275,2.871) 13(1.625,2.871) 14(0.975,2.871) 15(0.325,2.871) 16(-0.325,2.871) 17(-0.975,2.871) 18(-1.625,2.871) 19(-2.275,2.871) 20(-2.925,2.871)

## Nets
As in the schematic, except:
OSC_IN: 8M晶振.2 C16.2 R12.1 STM32.5
OSC_OUT: 8M晶振.1 C17.2 R12.2 STM32.6

Pads without a net: 74573 9 12; LDO1 4; RN1 1 16; STM32 1; USB电源 2 3 4 6

## Via types
v1: diameter 0.61, hole 0.305, Top Layer to Bottom Layer, 53 vias

## Routing (per net, layer and track width the routed paths; a pad name or vN(x,y) marks a point on that pad's centre or on a via; arc(x,y) is an arc through that point)
+5V: length 62.3
  Top Layer w0.508: 24.56,22.59 24.56,27.77 22.55,29.78 22.55,30.04 21.97,30.62 21.72,30.62 21.3,31.03 21.3,31.29 21.02,31.56 21.02,42.36 21.59,42.93 21.46,43.05 18.97,43.05 10.11,51.91 10.11,53.63 10.72,54.23 11.79,54.23 12.7,55.14 12.7,61.43 12.74,61.47 ; LDO1.1 15.64,60.63 14.76,61.52 14.25,61.52 ; USB电源.1 8.53,62.75 C10.2 C8.2 11.67,62.54 12.74,61.47 ; LDO1.3 15.26,62.53 14.25,61.52 ; 12.74,61.47 13.12,61.85 13.93,61.85 14.25,61.52
GND: length 204.3
  Top Layer w0.254: v1(61.85,68.58) 61.07,67.8 R11.1 58.44,67.56 SWD接口.4 49.66,67.56 警报北.1 39.2,57.11 34.59,57.11 33.62,56.13 北数码管.2 ; C16.1 31.89,20.46 30.48,19.05 30.48,17.02 31.75,15.75 40.13,15.75 41.15,16.76 41.15,17.02 41.4,17.27 41.4,18.8 40,20.19 38.86,20.19 38.72,20.34 C17.1 C14.1 35.8,28.59 v1(35.05,29.34) ; 52.5,18.81 57.62,18.81 59.83,16.6 59.83,15.66 60.49,15 61.43,15 64.96,18.53 64.96,23.42 警报东.1 ; STM32.47 30.14,36.68 30.14,36.77 29.59,37.31 27.86,37.31 26.94,38.23 26.54,38.23 25.87,38.9 ; 复位.1 60.65,26.11 v1(60.71,26.16) ; 警报南.1 50.57,6.98 51.06,6.49 52.28,6.49 52.77,6.98 53.71,6.98 红外南.2 ; 警报南.1 47.36,5.33 v1(47.5,5.33) ; 警报南.1 40.84,11.85 39.26,11.85 38.28,12.83 南数码管.2 ; 56.01,37.54 56.01,38.28 56.99,39.26 56.99,43.65 v1(57.53,44.2) ; 22.13,32.73 22.99,33.59 v1(22.99,34.16) ; 红外西.2 16.77,7.88 红外北.2 ; v1(38.74,46.99) 38.74,45.96 36.99,44.21 36.99,42.8 37.02,42.77 37.02,42.29 37.36,41.95 37.36,40.46 36.77,39.86 36.68,39.86 STM32.35 ; C8.1 C10.1 8.36,60.15 USB电源.5 ; STM32.23 40.09,33.09 41.96,33.09 v1(42.28,33.41) ; v1(29.59,38.86) 30.08,38.86 31.46,37.47 ; v1(44.07,28.07) 44.07,28.72 C13.1 42.33,30.45 41.55,30.45 40.16,31.85 39.33,31.85 38.66,32.53 38.54,32.53 ; 警报西.1 13.5,28.5 13.5,30.74 14.48,31.72 西数码管.2 ; 25.87,38.9 74573.1 ; 25.87,38.9 25.87,38.14 v1(26.67,37.34) ; v1(26.16,30.48) 26.16,29.58 25.72,29.14 74138.5 26.42,31.63 26.42,33.8 C18.1 25.54,33.54 v1(25.15,33.15) ; LDO1.2 17.34,61.58 C11.1 18.17,63.89 18.54,64.26 v1(19.3,64.26) 20.19,64.26 20.57,63.88 20.57,62.46 C9.1 ; 32.53,31.46 32.07,31.01 32.07,30.89 31.99,30.81 31.99,30.56 31.65,30.22 31.28,30.22 30.91,29.84 30.87,29.84 30.69,30.03 v1(30,30.03)
  Bottom Layer w0.254: v1(25.15,33.15) 24.13,34.16 v1(22.99,34.16)
  vias: v1(5.97,15.11) v1(66.29,3.43)
VCC_3V3: length 195.1
  Top Layer w0.254: STM32.48 28.66,34.67 C18.2 ; STM32.48 30.05,35.55 33.75,31.86 ; STM32.48 30.55,35.56 31.67,35.56 STM32.36 36.96,40.85 36.96,41.78 35.94,42.8 35.58,42.8 35.58,45.86 49.66,59.94 SWD接口.1 58.15,59.94 R10.1 ; 25.19,37.31 27.57,34.93 27.54,34.9 ; 25.19,37.31 23.37,39.13 23.37,41.78 27.11,45.53 27.11,45.98 74573.11 25.95,47.21 22.99,50.17 22.86,50.17 18.8,46.1 17.75,46.1 R1.1 14.35,56.03 14.35,59.01 15.24,59.9 ; 25.19,37.31 25.19,36.67 24.05,35.53 24.05,31.06 23.93,30.94 ; 15.24,59.9 14.39,59.9 13.66,60.63 ; 15.24,59.9 16.59,59.9 17.1,60.41 18.04,60.41 ; 33.75,31.86 33,31.11 32.88,31.11 ; 33.75,31.86 33.75,32.24 36.07,34.56 39.33,34.56 STM32.24 40.67,33.94 41.12,34.39 42.76,34.39 43.31,33.84 43.31,32.11 45.83,32.11 46.72,31.22 46.72,25.54 46.43,25.26 51.38,20.32 51.38,19.03 51.25,18.9 51.25,18.67 52.37,17.55 52.6,17.55 52.85,17.81 53.89,17.81 56.9,14.8 红外东.1 红外南.1 ; 33.75,31.86 33.8,31.81 33.8,31.65 34.79,30.66 34.79,30.31 33.8,29.32 C14.2 ; 23.93,30.85 23.26,30.18 23.26,29.82 25.2,27.89 25.2,23.17 25.33,23.04 25.33,22.57 15.32,12.56 14.88,12.56 红外北.1 14.23,7.88 ; C9.2 C11.2
A: length 114.2
  Top Layer w0.254: 56.13,35 51.56,39.57 v1(51.56,39.62) ; 北数码管.3 31.57,52.7 29.04,52.7 v1(27.95,51.61) 27.52,51.18 21.68,51.18 20.46,49.96 20.46,49.73 20.74,49.45 RN1.10
  Bottom Layer w0.254: v1(27.95,51.61) 27.95,48.47 西数码管.3 ; 南数码管.3 36.16,12.83 37.13,11.85 40.9,11.85 40.99,11.94 41.02,11.94 57.38,28.3 57.38,30.12 56.6,30.9 55.33,30.9 55.03,31.21 55.03,32.87 56.01,33.84 56.01,35 ; v1(51.56,39.62) 51.51,39.62 41.76,49.38 41.76,55.84 40.49,57.11 39.67,57.11 39.1,56.54 39.1,55.73 38.53,55.15 35.98,55.15 北数码管.3
B: length 152
  Top Layer w0.254: 北数码管.9 32.46,64.83 18.36,50.74 18.36,48.19 18.47,48.09 ; v1(17.02,47.66) 17.45,48.09 18.47,48.09 ; 18.47,48.09 RN1.15
  Bottom Layer w0.254: v1(17.02,47.66) 16.77,47.92 10.59,47.92 7.52,44.84 7.52,35.71 4.32,32.51 西数码管.9 3.68,31.83 3.68,30.67 2.7,29.69 2.7,25.36 9.19,18.88 21.58,18.88 36.91,3.56 36.91,3.3 南数码管.9 ; 北数码管.9 33.62,66.29 37.96,61.95 45.81,61.95 67.27,40.49 67.27,39.67 66.29,38.69 66.29,37.54
BEEP: length 10.1
  Top Layer w0.254: 蜂鸣器.2 48.51,33.27 48.26,33.53 47.73,33.53 47.62,33.42 47.14,33.42 46.74,33.82 44.03,33.82 43.05,34.8 41.72,34.8 41.19,35.33 41.19,35.46 40.46,36.19 40.08,36.19 STM32.25
C: length 183.6
  Top Layer w0.254: 北数码管.8 21.51,52.81 21.01,52.81 18.77,50.57 18.77,48.63 19.05,48.35 19.05,48.32 ; 19.05,48.32 19.05,48.22 RN1.14
  Bottom Layer w0.254: 东数码管.8 63.37,32.21 63.37,8.25 56.57,1.45 37.36,1.45 36.14,2.67 南数码管.8 ; 66.29,35 66.29,36.16 67.72,37.58 67.72,40.76 46.12,62.36 38.94,62.36 北数码管.8 33.93,67.36 29.46,67.36 7.11,45.01 7.11,37.79 西数码管.8
CS1: length 8.9
  Top Layer w0.254: 74138.1 28.5,26.53 28.5,28.21 28.1,28.6 28.1,31.6 28.58,32.08 30.19,32.08 30.99,32.88 31.11,32.88
CS2: length 8.3
  Top Layer w0.254: 27.52,27.34 27.6,27.43 27.6,31.85 28.24,32.49 30.01,32.49 STM32.3
CS3: length 7.9
  Top Layer w0.254: 74138.3 26.85,28.47 26.85,31.67 28.07,32.89 29.71,32.89 STM32.2
D: length 194
  Top Layer w0.254: 北数码管.6 30.9,57.11 28.93,57.11 23.81,51.99 21.34,51.99 19.65,50.3 19.65,49.16 19.76,49.06 19.76,49.02 20.03,48.74 20.03,48.64
  Bottom Layer w0.254: 西数码管.6 6.3,42.06 6.3,45.35 29.13,68.17 37.04,68.17 38.93,66.29 北数码管.6 41.2,66.29 44.25,63.25 46.38,63.25 68.53,41.09 68.53,38.97 68.94,38.56 68.94,30.79 68.07,29.92 66.29,29.92 ; 东数码管.6 66.42,29.67 66.42,7.62 59.44,0.63 31.95,0.63 南数码管.6
DIG1: length 48.5
  Top Layer w0.254: v1(21.6,28.99) 21.87,29.26 22.32,29.26 23.88,27.7 23.88,23.7 23.71,23.54
  Bottom Layer w0.254: v1(21.6,28.99) 22.44,28.99 28.79,35.33 28.79,65.16 北数码管.10
DIG2: length 41.8
  Top Layer w0.254: v1(21.6,28.15) 23.06,26.68 23.06,24.69 74138.14
  Bottom Layer w0.254: v1(21.6,28.15) 22.18,28.15 40.08,46.05 40.08,49.32 41.35,50.59 41.35,54.86 北数码管.5
DIG3: length 25.4
  Top Layer w0.254: v1(5.72,24.89) 5.72,28.52 西数码管.10 ; 21.58,25 21.58,23.53 v1(20.33,22.28)
  Bottom Layer w0.254: v1(20.33,22.28) 19.26,21.21 9.4,21.21 v1(5.72,24.89)
DIG4: length 16.9
  Top Layer w0.254: 西数码管.5 15.68,38.88 15.68,35.12 21.01,29.79 21.01,26.23 74138.12
DIG5: length 35
  Top Layer w0.254: 19.86,26.88 19.61,26.62 19.61,22.05 20.88,20.78 v1(22.02,20.78)
  Bottom Layer w0.254: 南数码管.10 40.08,3.81 31.29,12.6 31.29,14.17 24.69,20.78 v1(22.02,20.78)
DIG6: length 21.4
  Top Layer w0.254: 74138.10 18.71,27.52 18.71,22.18 20.79,20.1 v1(21.25,20.1)
  Bottom Layer w0.254: v1(21.25,20.1) 23.79,20.1 29.92,13.97 南数码管.5
DIG7: length 57.1
  Top Layer w0.254: 18.07,28.67 18.32,28.92 19.84,28.92 v1(20.1,28.67)
  Bottom Layer w0.254: 66.29,40.08 65.15,40.08 63.75,38.68 49.54,38.68 36.16,25.3 21.57,25.3 20.1,26.77 v1(20.1,28.67)
DIG8: length 47.1
  Top Layer w0.254: 74138.7 22.52,31.83 v1(22.01,31.33)
  Bottom Layer w0.254: v1(22.01,31.33) 21.93,31.33 18.71,28.11 18.71,27.58 21.4,24.89 51.23,24.89 56.13,29.79 56.13,29.92
DIGA: length 5.4
  Top Layer w0.254: 74573.7 29.16,41.17 30.59,41.17 32.88,38.89
DIGB: length 5.5
  Top Layer w0.254: STM32.46 29.81,37.72 28.02,37.72 74573.2
DIGC: length 5.5
  Top Layer w0.254: 31.11,37.12 30.11,38.13 28.54,38.13 26.79,39.87
DIGD: length 5.5
  Top Layer w0.254: 27.71,40.79 28.22,40.28 30.07,40.28 STM32.42
DIGE: length 5.6
  Top Layer w0.254: 74573.4 27.98,39.61 30.04,39.61 STM32.43
DIGF: length 5.4
  Top Layer w0.254: STM32.39 30.81,41.66 29.59,41.66 74573.8
DIGG: length 5.5
  Top Layer w0.254: 32.53,38.54 30.37,40.69 28.73,40.69 74573.6
E: length 189
  Top Layer w0.254: RN1.13 19.18,48.8 19.18,50.4 21.18,52.4 23.65,52.4 北数码管.7
  Bottom Layer w0.254: 南数码管.7 32.89,2.67 34.52,1.04 58.42,1.04 64.77,7.39 64.77,30.94 66.29,32.46 66.29,33.61 68.12,35.44 68.12,40.92 46.28,62.76 39.85,62.76 37.54,65.08 北数码管.7 36.38,66.29 34.91,67.77 29.3,67.77 6.71,45.18 6.71,39.93 西数码管.7
F: length 112.3
  Top Layer w0.254: 北数码管.4 31.05,49.64 v1(24.84,49.64) 23.91,50.57 22.69,50.57 21.83,49.71 RN1.9 ; 56.01,32.46 56.01,33.61 56.99,34.59 56.99,35.41 55.83,36.56 55.6,36.56 52.73,39.44 v1(52.7,39.44)
  Bottom Layer w0.254: 56.01,32.46 56.13,32.33 57.33,32.33 57.78,31.88 57.78,27.09 52.37,21.67 51.69,21.67 50.21,20.19 50.21,19.51 41.74,11.05 35.89,11.05 35.09,11.85 34.59,11.85 33.62,12.83 南数码管.4 ; 北数码管.4 38.12,56.13 39.51,57.52 40.65,57.52 42.16,56.01 42.16,49.85 52.58,39.44 v1(52.7,39.44) ; 西数码管.4 14.48,37.9 23.75,47.17 23.75,48.55 v1(24.84,49.64)
G: length 125.2
  Top Layer w0.254: 北数码管.1 25.37,51.59 21.51,51.59 20.06,50.13 20.06,49.33 RN1.11 ; v1(29.41,44.85) v1(24.08,39.52)
  Bottom Layer w0.254: v1(24.08,39.52) 西数码管.1 14.48,28.32 18.92,23.88 23.24,23.88 30.48,16.64 37.41,16.64 40.08,13.97 南数码管.1 ; v1(29.41,44.85) 30.35,45.8 30.35,55.7 北数码管.1 30.81,56.13 33.34,58.66 48.52,58.66 59.56,47.62 59.56,43.32 56.33,40.08 56.13,40.08
GREENEW: length 30.5
  Top Layer w0.254: 38.54,37.47 40.56,39.5 44.25,39.5 45.27,38.48 46.46,38.48 51.44,43.45 51.44,50.2 西LED.1 52.18,50.56 东LED.1
GREENSN: length 12.6
  Top Layer w0.254: 37.47,38.54 37.48,38.54 北LED.1 42.4,43.2 南LED.1
INFREE: length 25.5
  Top Layer w0.254: STM32.14 46.53,20.29 46.53,15.58 49.53,12.57 红外东.3
INFREN: length 24.6
  Top Layer w0.254: 红外北.3 19.31,15.12 29.84,25.65 v1(29.84,26.54) ; v1(31.87,29.07) 32.12,29.07 32.21,29.15 32.34,29.15 STM32.11
  Bottom Layer w0.254: v1(29.84,26.54) 29.84,27.04 v1(31.87,29.07)
INFRES: length 30.1
  Top Layer w0.254: 红外南.3 49.78,7.62 46.12,11.28 46.12,19.98 36.06,30.04 STM32.13
INFREW: length 29.4
  Top Layer w0.254: STM32.12 33.94,30.04 33.53,29.63 33.4,29.63 33.32,29.55 33.31,29.55 32.5,28.75 32.5,28.62 v1(32.45,28.57) ; v1(30.61,26.03) 30.58,26.03 30.25,25.7 30.25,25.49 19.71,14.95 19.71,13.11 20.44,12.38 20.44,11.45 19,10 19,8.18 红外西.3
  Bottom Layer w0.254: v1(32.45,28.57) 31.75,27.87 31.75,26.8 30.99,26.03 v1(30.61,26.03)
LEDE: length 35.2
  Top Layer w0.254: 38.89,32.88 39.51,32.26 40.33,32.26 41.72,30.86 44.32,30.86 45.78,29.4 45.78,26.37 44.89,25.47 44.89,24.85 46.02,23.71 46.65,23.71 50.41,19.94 v1(50.79,19.94) ; 警报东.2 54.74,23.87 v1(51.96,21.09)
  Bottom Layer w0.254: v1(51.96,21.09) 51.93,21.09 v1(50.79,19.94)
LEDN: length 27.3
  Top Layer w0.254: 警报北.2 45.72,57.16 33.09,44.52 33.09,40.09 STM32.38
LEDS: length 29.3
  Top Layer w0.254: STM32.18 37.33,32.31 36.87,32.31 35.21,30.66 35.21,30.31 45.72,19.81 警报南.2
LEDW: length 33.4
  Top Layer w0.254: STM32.10 32.21,29.74 31.55,29.74 31.11,29.3 v1(31.11,29.26) ; v1(19.77,30) 17.55,30 11.82,24.26 警报西.2
  Bottom Layer w0.254: v1(31.11,29.26) 29.05,27.2 21.55,27.2 20.79,27.96 20.79,29.23 22.82,31.27 22.82,31.52 22.31,32.03 21.8,32.03 v1(19.77,30)
OSC_IN: length 20
  Top Layer w0.254: 8M晶振.2 34.31,18.97 R12.1 34.31,23.84 C16.2 30.72,27.43 29.91,27.43 28.51,28.83 28.51,31.37 28.81,31.67 30.49,31.67 31.34,32.53 31.46,32.53
OSC_OUT: length 22.5
  Top Layer w0.254: STM32.6 30.94,31.29 30.69,31.29 30.51,31.11 28.91,31.11 28.91,29.08 30.06,27.94 31.26,27.94 32.98,26.22 34.75,26.22 C17.2 36.31,23.84 R12.2 36.31,19.7 37.97,18.03 8M晶振.1
PA5: length 37.1
  Top Layer w0.254: 60.96,18.67 64.01,21.72 64.01,24.6 63.75,24.85 50.55,24.85 49.47,25.93 v1(49.47,26.19) ; STM32.15 38.04,29.49 39.05,29.49 v1(42.36,26.19)
  Bottom Layer w0.254: v1(42.36,26.19) v1(49.47,26.19)
PA6: length 41.8
  Top Layer w0.254: v1(43.73,25.52) 43.73,25.8 40.13,29.4 39.82,29.4 38.66,30.55 37.68,30.55 37.12,31.11 ; 扩展1.2 64.55,19.72 64.55,24.76 62.01,27.3 52.62,27.3 v1(50.84,25.52)
  Bottom Layer w0.254: v1(43.73,25.52) v1(50.84,25.52)
PA7: length 51.3
  Top Layer w0.254: 37.47,31.46 37.98,30.96 39,30.96 39.88,30.07 v1(39.97,30.07) ; v1(47.38,34) 47.16,34.23 44.51,34.23 43.17,35.57 v1(41.77,35.57)
  Bottom Layer w0.254: v1(47.38,34) 49.72,36.34 56.22,36.34 58.67,33.89 58.67,15.88 扩展1.3 ; v1(41.77,35.57) 41.54,35.57 38.75,32.78 38.75,31.21 39.88,30.07 v1(39.97,30.07)
PA12: length 38
  Top Layer w0.254: 扩展3.1 60.86,58.95 56.17,58.95 40.42,43.21 40.42,42.19 37.12,38.89
PB1: length 39.4
  Top Layer w0.254: 67.06,49.66 59.73,49.66 47.07,37 v1(45.04,37) ; v1(40.33,30.78) 40.04,30.78 39.97,30.72 39.81,30.72 39.17,31.36 38.87,31.36 38.18,32.05 STM32.19
  Bottom Layer w0.254: v1(45.04,37) 44.62,37 41.35,33.73 40.78,33.73 40.44,33.39 40.44,32.91 40.91,32.43 40.91,31.07 40.62,30.78 v1(40.33,30.78)
PB11: length 41
  Top Layer w0.254: v1(41.65,31.88) 41.09,32.44 41.03,32.44 40.8,32.66 39.81,32.66 STM32.22 ; v1(50.67,39.58) 59.31,48.22 68.07,48.22 68.58,48.73 68.58,50.67 扩展2.2
  Bottom Layer w0.254: v1(50.67,39.58) 49.87,39.58 42.16,31.88 v1(41.65,31.88)
PB13: length 56.7
  Top Layer w0.254: STM32.26 40.1,36.92 43.91,36.92 46.2,34.64 48.99,34.64 52.3,31.33 56.36,31.33 65,39.97 65,44.54 69.06,48.61 69.06,60.86 扩展3.2
REDEW: length 29.7
  Top Layer w0.254: 53.59,48.53 53.59,45.04 46.63,38.07 45.1,38.07 44.08,39.09 40.89,39.09 38.92,37.12 38.89,37.12 ; 53.59,48.53 西LED.2 ; 53.59,48.53 53.74,48.53 东LED.2
REDSN: length 13.7
  Top Layer w0.254: STM32.31 37.83,38.21 41.34,41.72 43.63,41.72 北LED.2 44.2,41.4 南LED.2
RST: length 27
  Top Layer w0.254: v1(38.85,28.81) 44.07,23.59 R8.1 51.09,17.39 ; STM32.7 31.66,31.31 31.66,31.06 v1(31.4,30.8)
  Bottom Layer w0.254: v1(31.4,30.8) 32.13,30.07 38.28,30.07 38.85,29.5 v1(38.85,28.81)
SWCLK: length 39.3
  Top Layer w0.254: 33.5,40.51 33.5,44.35 46.13,56.99 46.13,59.34 51.82,65.02 SWD接口.3 57.9,65.02 R11.2
SWIO: length 47.9
  Top Layer w0.254: STM32.34 37.97,40.45 37.97,42.99 54.52,59.54 59.39,59.54 59.77,59.91 59.77,61.28 59.6,61.44 53.88,61.44 SWD接口.2 52.94,62.59 R10.2
YELLOWEW: length 28.6
  Top Layer w0.254: STM32.27 39.24,36.83 41.02,38.61 43.99,38.61 44.93,37.66 46.8,37.66 54,44.87 54,45.58 西LED.3 55.77,46.97 60.47,51.67
YELLOWSN: length 14.8
  Top Layer w0.254: 南LED.3 45.99,39.61 北LED.3 45.07,40.27 40.63,40.27 STM32.30
$1N2600: length 2.6
  Top Layer w0.254: R1.2 8.96,52.64 电源LED.1
$1N11019: length 3.7
  Top Layer w0.254: RN1.2 21.59,44.97 21.59,44.15 22.18,43.56
$1N11023: length 3.7
  Top Layer w0.254: RN1.3 22.22,45.04 22.22,44.44 74573.18
$1N11028: length 3.7
  Top Layer w0.254: 74573.17 22.64,44.94 22.64,45.34 RN1.4
$1N11033: length 3.6
  Top Layer w0.254: 74573.16 23.11,45.39 23.11,45.57 21.21,47.47
$1N11038: length 3.6
  Top Layer w0.254: RN1.6 21.6,47.82 74573.15
$1N11043: length 3.6
  Top Layer w0.254: RN1.7 23.74,46.36 23.99,46.36 74573.14
$1N11048: length 3.7
  Top Layer w0.254: 25.03,46.23 22.73,48.53 RN1.8

## Copper pours and planes (outline as drawn; the poured copper is in the pictures)
GND on Top Layer: -5.59,73.28 72.39,73.28 72.39,-3.43 -5.59,-3.43
GND on Bottom Layer: -6.1,74.55 77.34,74.55 77.34,-2.29 -6.1,-2.29

Small or netless copper shapes (teardrops, artwork), in the pictures only: 211 on Top Layer, 74 on Bottom Layer

## Text on the board
Top Silkscreen Layer: VCC | GND | INFREN | PA12 | PB11 | PB13 | PB1 | SWCLK | SWIO | PA5 | PA6 | PA7 | GREEN | RED | YELLOW | BEEP
